# EAGLE design controller_board (EAGLE 9.6.2)
Drink Mixing Machine -- Controller Board v3.1
REVISION: v3.1
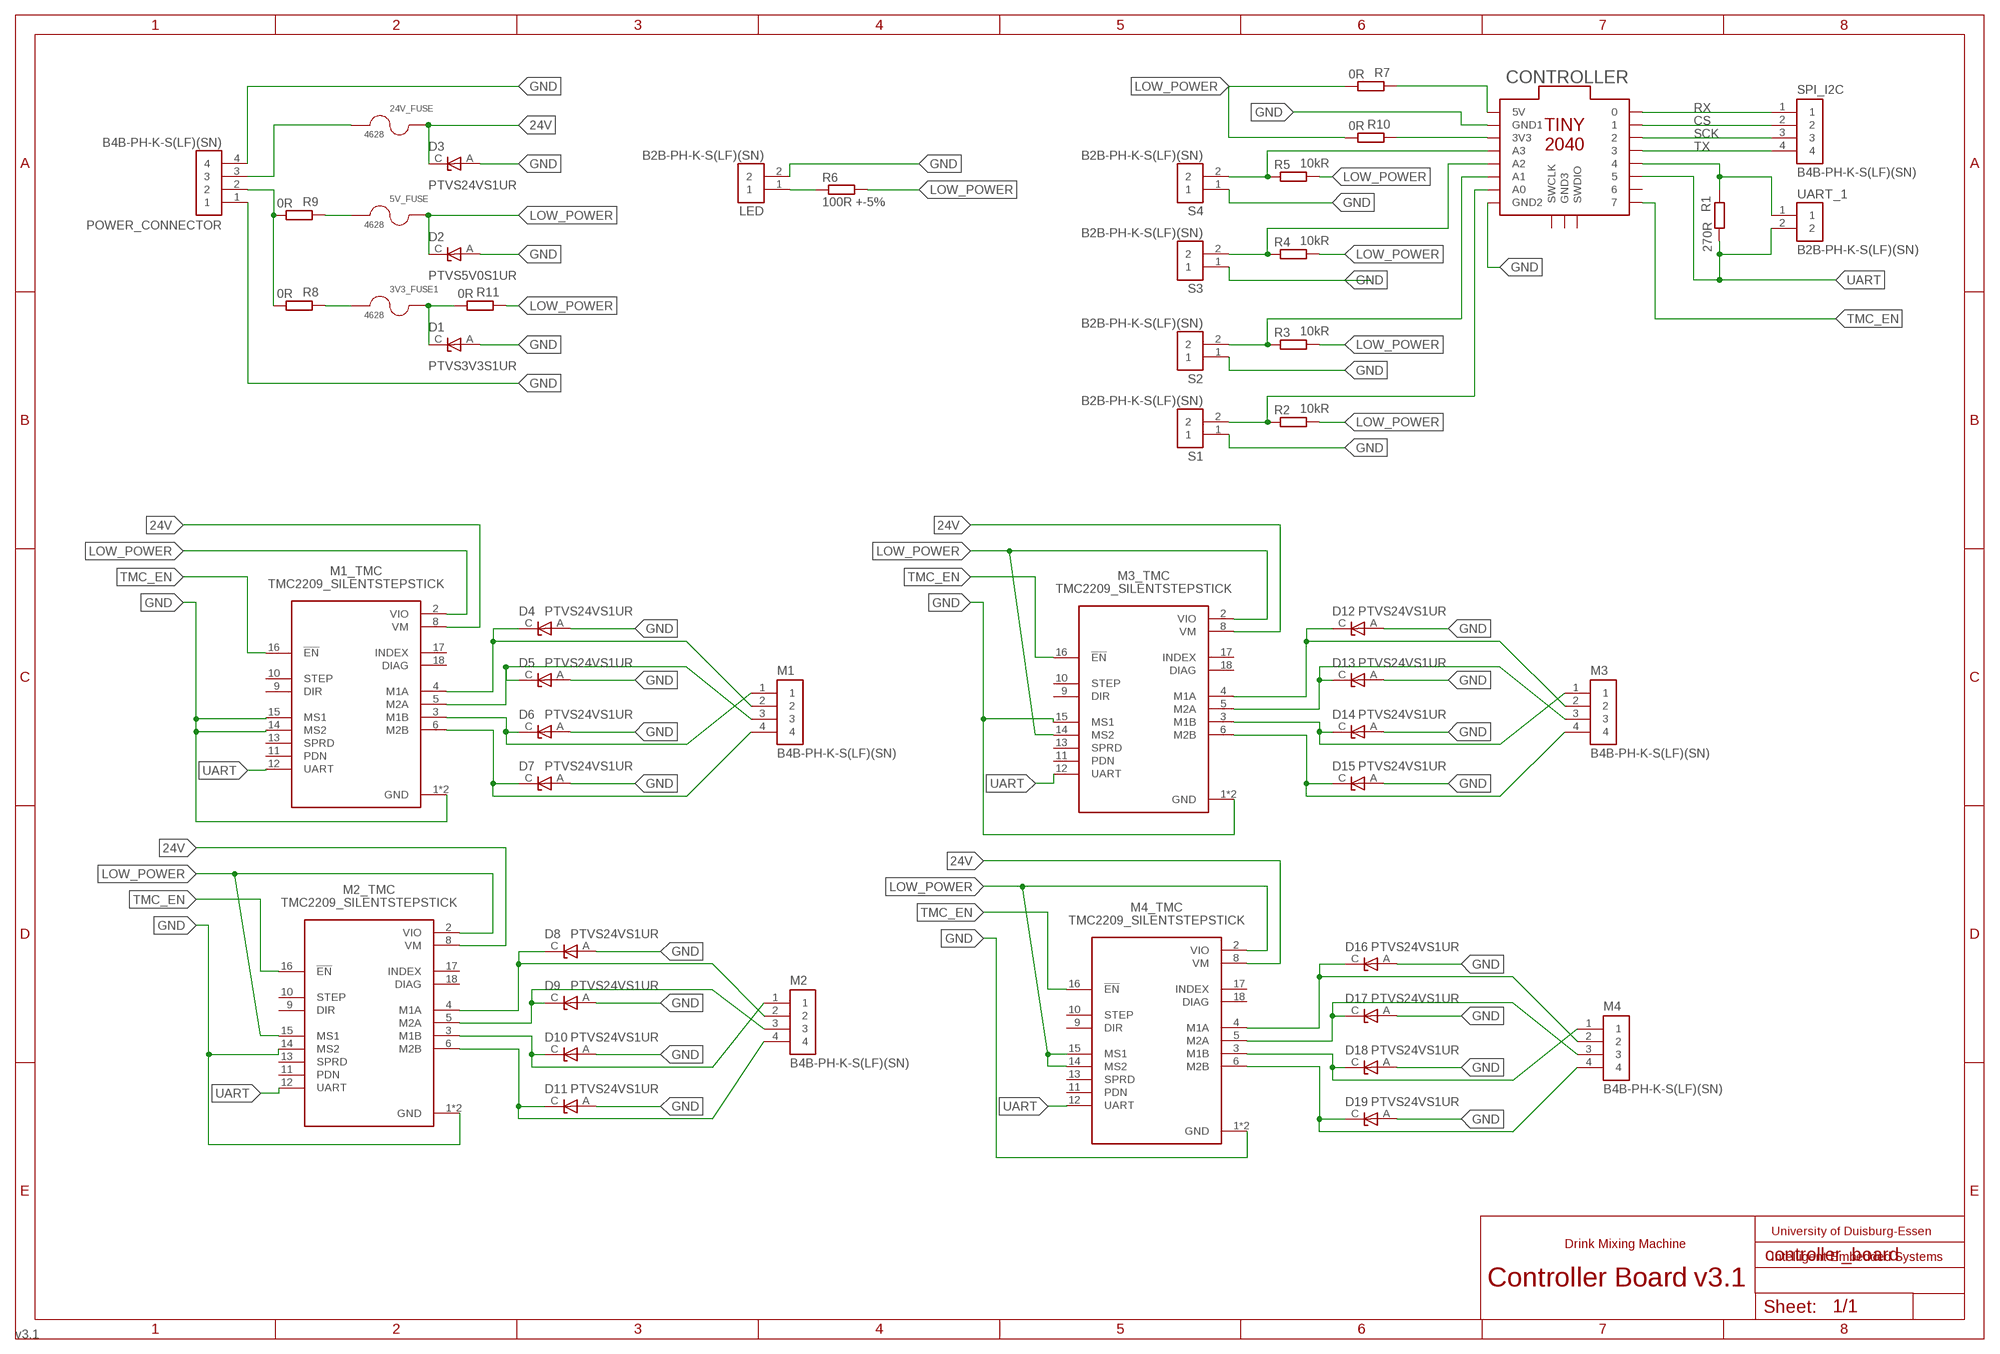
[diagram p0: schematic, sheet 1]
FRAME1 (A3L-LOC): VERSION: v3.1

## Parts
3V3_FUSE1  4628  [FUSE_4628]
5V_FUSE  4628  [FUSE_4628]
24V_FUSE  4628  [FUSE_4628]
CONTROLLER  TINY2040_HEADER  [TINY2040_HEADER]
D1  PTVS3V3S1UR  [TVS_PTVS3V3S1UR]
D2  PTVS5V0S1UR  [TVS_PTVS5V0S1UR]
D3  PTVS24VS1UR  [TVS_PTVS24VS1UR]
D4  PTVS24VS1UR  [TVS_PTVS24VS1UR]
D5  PTVS24VS1UR  [TVS_PTVS24VS1UR]
D6  PTVS24VS1UR  [TVS_PTVS24VS1UR]
D7  PTVS24VS1UR  [TVS_PTVS24VS1UR]
D8  PTVS24VS1UR  [TVS_PTVS24VS1UR]
D9  PTVS24VS1UR  [TVS_PTVS24VS1UR]
D10  PTVS24VS1UR  [TVS_PTVS24VS1UR]
D11  PTVS24VS1UR  [TVS_PTVS24VS1UR]
D12  PTVS24VS1UR  [TVS_PTVS24VS1UR]
D13  PTVS24VS1UR  [TVS_PTVS24VS1UR]
D14  PTVS24VS1UR  [TVS_PTVS24VS1UR]
D15  PTVS24VS1UR  [TVS_PTVS24VS1UR]
D16  PTVS24VS1UR  [TVS_PTVS24VS1UR]
D17  PTVS24VS1UR  [TVS_PTVS24VS1UR]
D18  PTVS24VS1UR  [TVS_PTVS24VS1UR]
D19  PTVS24VS1UR  [TVS_PTVS24VS1UR]
LED  B2B-PH-K-S(LF)(SN)  [JST_B2B-PH-K-S(LF)(SN)]
M1  B4B-PH-K-S(LF)(SN)  [JST_B4B-PH-K-S(LF)(SN)]
M1_TMC  TMC2209_SILENTSTEPSTICK  [MODULE_TMC2209_SILENTSTEPSTICK]
M2  B4B-PH-K-S(LF)(SN)  [JST_B4B-PH-K-S(LF)(SN)]
M2_TMC  TMC2209_SILENTSTEPSTICK  [MODULE_TMC2209_SILENTSTEPSTICK]
M3  B4B-PH-K-S(LF)(SN)  [JST_B4B-PH-K-S(LF)(SN)]
M3_TMC  TMC2209_SILENTSTEPSTICK  [MODULE_TMC2209_SILENTSTEPSTICK]
M4  B4B-PH-K-S(LF)(SN)  [JST_B4B-PH-K-S(LF)(SN)]
M4_TMC  TMC2209_SILENTSTEPSTICK  [MODULE_TMC2209_SILENTSTEPSTICK]
POWER_CONNECTOR  B4B-PH-K-S(LF)(SN)  [JST_B4B-PH-K-S(LF)(SN)]
R1  270R  R-EU_R0805  [R0805]
R2  10kR  R-EU_R0805  [R0805]
R3  10kR  R-EU_R0805  [R0805]
R4  10kR  R-EU_R0805  [R0805]
R5  10kR  R-EU_R0805  [R0805]
R6  100R +-5%  R-EU_R0805  [R0805]
R7  0R  R-EU_R0805  [R0805]
R8  0R  R-EU_R0805  [R0805]
R9  0R  R-EU_R0805  [R0805]
R10  0R  R-EU_R0805  [R0805]
R11  0R  R-EU_R0805  [R0805]
S1  B2B-PH-K-S(LF)(SN)  [JST_B2B-PH-K-S(LF)(SN)]
S2  B2B-PH-K-S(LF)(SN)  [JST_B2B-PH-K-S(LF)(SN)]
S3  B2B-PH-K-S(LF)(SN)  [JST_B2B-PH-K-S(LF)(SN)]
S4  B2B-PH-K-S(LF)(SN)  [JST_B2B-PH-K-S(LF)(SN)]
SPI_I2C  B4B-PH-K-S(LF)(SN)  [JST_B4B-PH-K-S(LF)(SN)]
UART_1  B2B-PH-K-S(LF)(SN)  [JST_B2B-PH-K-S(LF)(SN)]

## Nets
3V3: 3V3_FUSE1.2 D1.C R11.2
24V: 24V_FUSE.2 D3.C M1_TMC.8(VM) M2_TMC.8(VM) M3_TMC.8(VM) M4_TMC.8(VM)
A0: CONTROLLER.A0 R2.1 S1.2
A1: CONTROLLER.A1 R3.1 S2.2
A2: CONTROLLER.A2 R4.1 S3.2
CS: CONTROLLER.1 SPI_I2C.2
GND: CONTROLLER.GND1 CONTROLLER.GND2 D1.A D2.A D3.A D4.A D5.A D6.A D7.A D8.A D9.A D10.A D11.A D12.A D13.A D14.A D15.A D16.A D17.A D18.A D19.A LED.2 M1_TMC.1(GND) M1_TMC.7(GND) M1_TMC.14(MS2) M1_TMC.15(MS1) M2_TMC.1(GND) M2_TMC.7(GND) M2_TMC.14(MS2) M3_TMC.1(GND) M3_TMC.7(GND) M3_TMC.15(MS1) M4_TMC.1(GND) M4_TMC.7(GND) POWER_CONNECTOR.1 POWER_CONNECTOR.4 S1.1 S2.1 S3.1 S4.1
LOW_POWER: 5V_FUSE.2 D2.C M1_TMC.2(VIO) M2_TMC.2(VIO) M2_TMC.15(MS1) M3_TMC.2(VIO) M3_TMC.14(MS2) M4_TMC.2(VIO) M4_TMC.14(MS2) M4_TMC.15(MS1) R2.2 R3.2 R4.2 R5.2 R6.2 R7.2 R10.2 R11.1
N$1: POWER_CONNECTOR.2 R8.2 R9.2
N$2: D4.C M1.2 M1_TMC.4(M1A)
N$3: 5V_FUSE.1 R9.1
N$4: D6.C M1.1 M1_TMC.3(M1B)
N$5: D8.C M2.2 M2_TMC.4(M1A)
N$6: D11.C M2.4 M2_TMC.6(M2B)
N$7: D9.C M2.3 M2_TMC.5(M2A)
N$8: D10.C M2.1 M2_TMC.3(M1B)
N$9: D12.C M3.2 M3_TMC.4(M1A)
N$10: D15.C M3.4 M3_TMC.6(M2B)
N$11: D13.C M3.3 M3_TMC.5(M2A)
N$12: D14.C M3.1 M3_TMC.3(M1B)
N$13: D16.C M4.2 M4_TMC.4(M1A)
N$14: D19.C M4.4 M4_TMC.6(M2B)
N$15: D17.C M4.3 M4_TMC.5(M2A)
N$16: D18.C M4.1 M4_TMC.3(M1B)
N$17: LED.1 R6.1
N$18: CONTROLLER.5V R7.1
N$19: D7.C M1.4 M1_TMC.6(M2B)
N$20: CONTROLLER.4 R1.1 UART_1.1
N$21: 3V3_FUSE1.1 R8.1
N$22: 24V_FUSE.1 POWER_CONNECTOR.3
N$23: CONTROLLER.3V3 R10.1
N$24: CONTROLLER.A3 R5.1 S4.2
N$26: D5.C M1.3 M1_TMC.5(M2A)
RX: CONTROLLER.0 SPI_I2C.1
SCK: CONTROLLER.2 SPI_I2C.3
TMC_EN: CONTROLLER.7 M1_TMC.16(!EN) M2_TMC.16(!EN) M3_TMC.16(!EN) M4_TMC.16(!EN)
TX: CONTROLLER.3 SPI_I2C.4
UART: CONTROLLER.5 M1_TMC.12(UART) M2_TMC.12(UART) M3_TMC.12(UART) M4_TMC.12(UART) R1.2 UART_1.2
Unconnected: CONTROLLER.6 CONTROLLER.GND3 CONTROLLER.SWCLK CONTROLLER.SWDIO M1_TMC.9(DIR) M1_TMC.10(STEP) M1_TMC.11(PDN) M1_TMC.13(SPRD) M1_TMC.17(INDEX) M1_TMC.18(DIAG) M2_TMC.9(DIR) M2_TMC.10(STEP) M2_TMC.11(PDN) M2_TMC.13(SPRD) M2_TMC.17(INDEX) M2_TMC.18(DIAG) M3_TMC.9(DIR) M3_TMC.10(STEP) M3_TMC.11(PDN) M3_TMC.13(SPRD) M3_TMC.17(INDEX) M3_TMC.18(DIAG) M4_TMC.9(DIR) M4_TMC.10(STEP) M4_TMC.11(PDN) M4_TMC.13(SPRD) M4_TMC.17(INDEX) M4_TMC.18(DIAG)

## Notes on the sheet
- University of Duisburg-Essen
- Drink Mixing Machine
- Intelligent Embedded Systems
- Controller Board

## Library data of the parts
3V3_FUSE1 5V_FUSE 24V_FUSE = 4628:4628: Check availability <https://pricing.snapeda.com/parts/4628/Keystone/view-part?ref=eda>; AVAILABILITY: In Stock; DESCRIPTION: 5mm Slim Line Fuse holder; MF: Keystone; MP: 4628; PACKAGE: None; PRICE: None; PURCHASE-URL: https://pricing.snapeda.com/search?q=4628&ref=eda
CONTROLLER = tiny2040_headerd:TINY2040_HEADER
D1 = PTVS3V3S1UR:PTVS3V3S1UR: Check availability <https://pricing.snapeda.com/parts/PTVS3V3S1UR/Nexperia/view-part?ref=eda>; AVAILABILITY: In Stock; CHECK_PRICES: https://www.snapeda.com/parts/PTVS3V3S1UR/Nexperia/view-part/?ref=eda; DESCRIPTION: Diode TVS Single Uni-Dir 3.3V 400W Automotive 2-Pin SOD-123W T/R; MF: Nexperia; MP: PTVS3V3S1UR; PACKAGE: None; PRICE: None; SNAPEDA_LINK: https://www.snapeda.com/parts/PTVS3V3S1UR/Nexperia/view-part/?ref=snap
D2 = PTVS5V0S1UR:PTVS5V0S1UR: Check availability <https://pricing.snapeda.com/parts/PTVS5V0S1UR/Nexperia%20USA/view-part?ref=eda>; AVAILABILITY: In Stock; CHECK_PRICES: https://www.snapeda.com/parts/PTVS5V0S1UR/Nexperia/view-part/?ref=eda; DESCRIPTION: 9.2V Clamp 43.5A Ipp Tvs Diode Surface Mount SOD-123W; MF: Nexperia USA; MP: PTVS5V0S1UR; PACKAGE: SOD-123 Nexperia USA; PRICE: None; PURCHASE-URL: https://www.snapeda.com/api/url_track_click_mouser/?unipart_id=2712262&manufacturer=Nexperia USA&part_name=PTVS5V0S1UR&search_term=ptvs5v0s1ur; SNAPEDA_LINK: https://www.snapeda.com/parts/PTVS5V0S1UR/Nexperia/view-part/?ref=snap
D3-D19 = PTVS24VS1UR:PTVS24VS1UR: Check availability <https://pricing.snapeda.com/parts/PTVS24VS1UR/Nexperia/view-part?ref=eda>; AVAILABILITY: In Stock; CHECK_PRICES: https://www.snapeda.com/parts/PTVS24VS1UR/Nexperia/view-part/?ref=eda; DESCRIPTION: TVS Diode Single Uni-Dir 24V 400W Automotive 2-Pin SOD-123W T/R; MF: Nexperia; MP: PTVS24VS1UR; PACKAGE: None; PRICE: None; SNAPEDA_LINK: https://www.snapeda.com/parts/PTVS24VS1UR/Nexperia/view-part/?ref=snap
LED S1-S4 UART_1 = B2B-PH-K-S_LF__SN_:B2B-PH-K-S(LF)(SN): PH Series 2 Position 2 mm Pitch Through Hole Top Entry Shrouded Header Check availability <https://pricing.snapeda.com/parts/B2B-PH-K-S%20%28LF%29%28SN%29/JST/view-part?ref=eda>; AVAILABILITY: In Stock; DESCRIPTION: Connector Header Through Hole 2 position 0.079 (2.00mm); MF: JST; MP: B2B-PH-K-S (LF)(SN); PACKAGE: None; PRICE: None
M1-M4 POWER_CONNECTOR SPI_I2C = B4B-PH-K-S_LF__SN_:B4B-PH-K-S(LF)(SN): PH Series 4 Position 2 mm Pitch Through Hole Crimp Top Entry Shrouded Header Check availability <https://pricing.snapeda.com/parts/B4B-PH-K-S%28LF%29%28SN%29/JST%20Sales/view-part?ref=eda>; AVAILABILITY: In Stock; DESCRIPTION: Connector Header Through Hole 4 position 0.079 (2.00mm); MF: JST Sales; MP: B4B-PH-K-S(LF)(SN); PACKAGE: None; PRICE: None
M1_TMC M2_TMC M3_TMC M4_TMC = TMC2209_SILENTSTEPSTICK:TMC2209_SILENTSTEPSTICK: Check availability <https://pricing.snapeda.com/parts/TMC2209%20SILENTSTEPSTICK/Trinamic%20Motion%20Control%20GmbH/view-part?ref=eda>; AVAILABILITY: In Stock; DESCRIPTION: TMC2209 Motor Controller/Driver Power Management Evaluation Board; MF: Trinamic Motion Control GmbH; MP: TMC2209 SILENTSTEPSTICK; PACKAGE: None; PRICE: None; PURCHASE-URL: https://pricing.snapeda.com/search?q=TMC2209 SILENTSTEPSTICK&ref=eda
R1-R11 = rcl:R-EU_: RESISTOR, European symbol; SPICEPREFIX: R

## Board
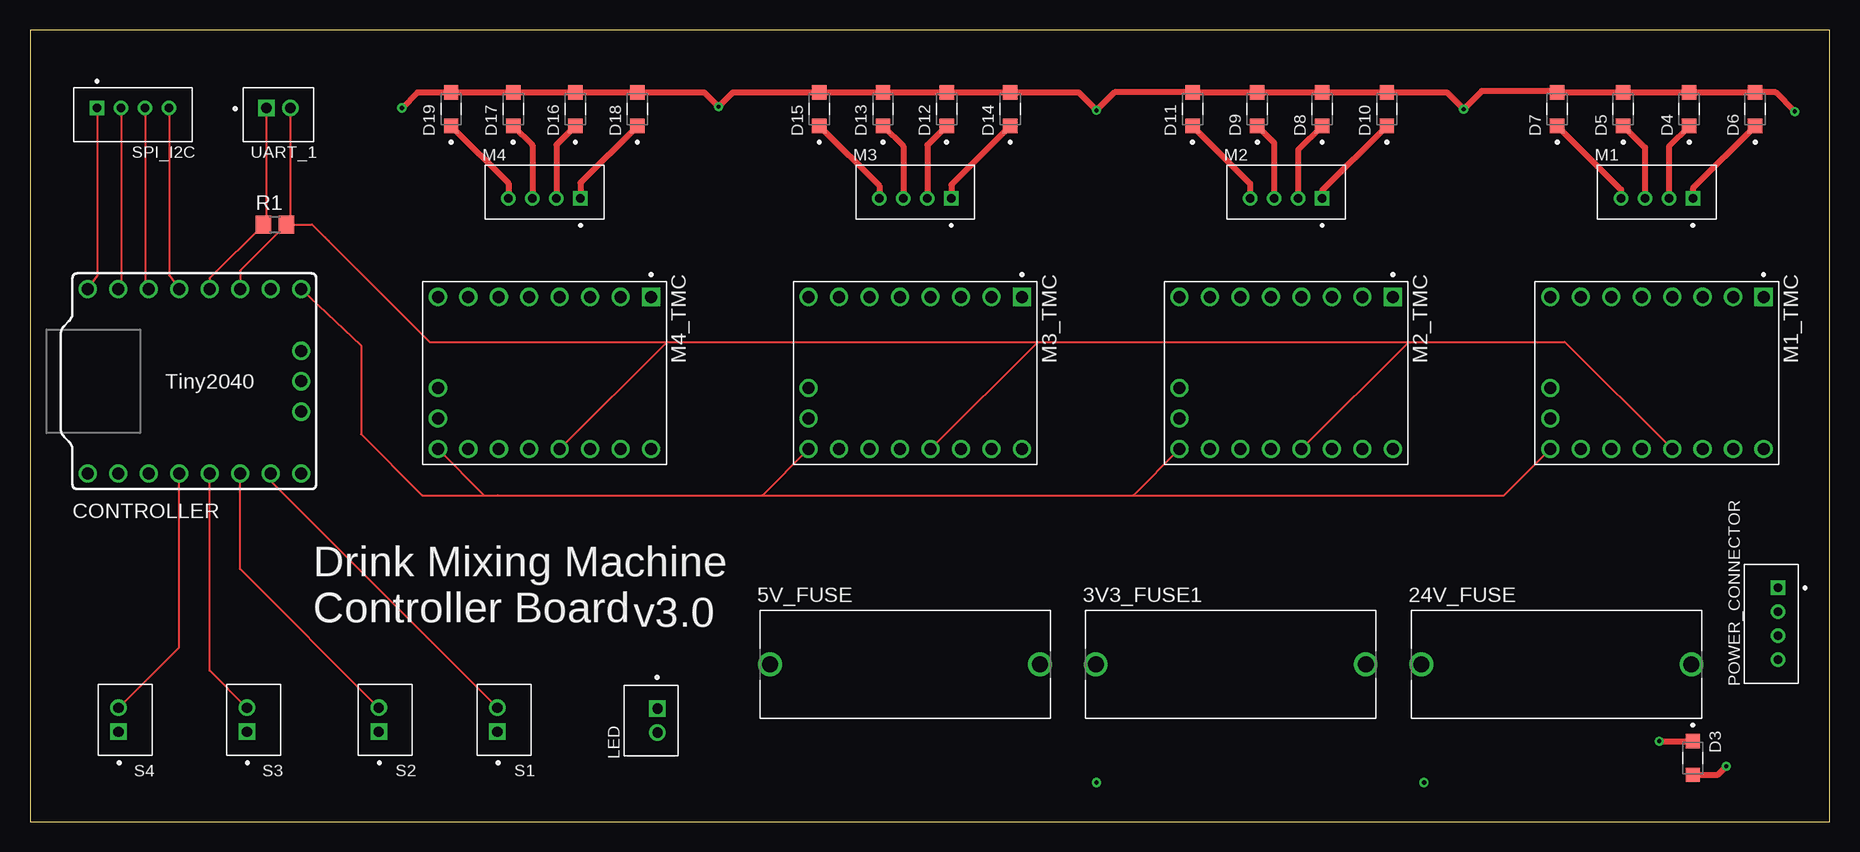
[diagram p1: board, top side]
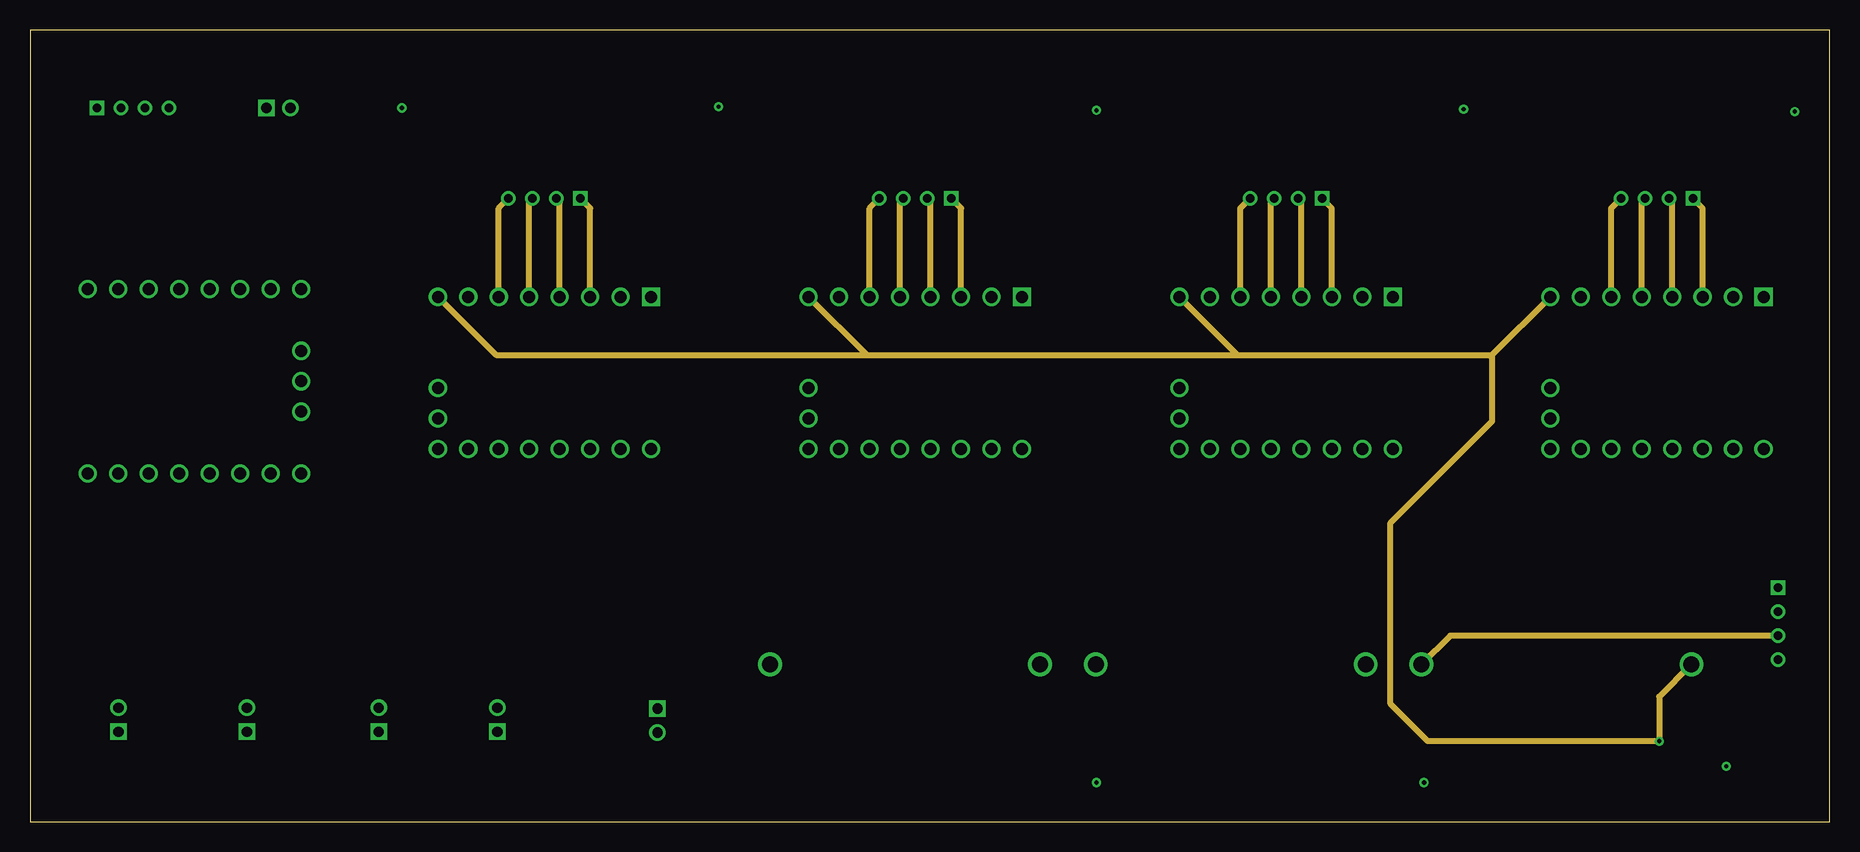
[diagram p2: board, inner layer Route2]
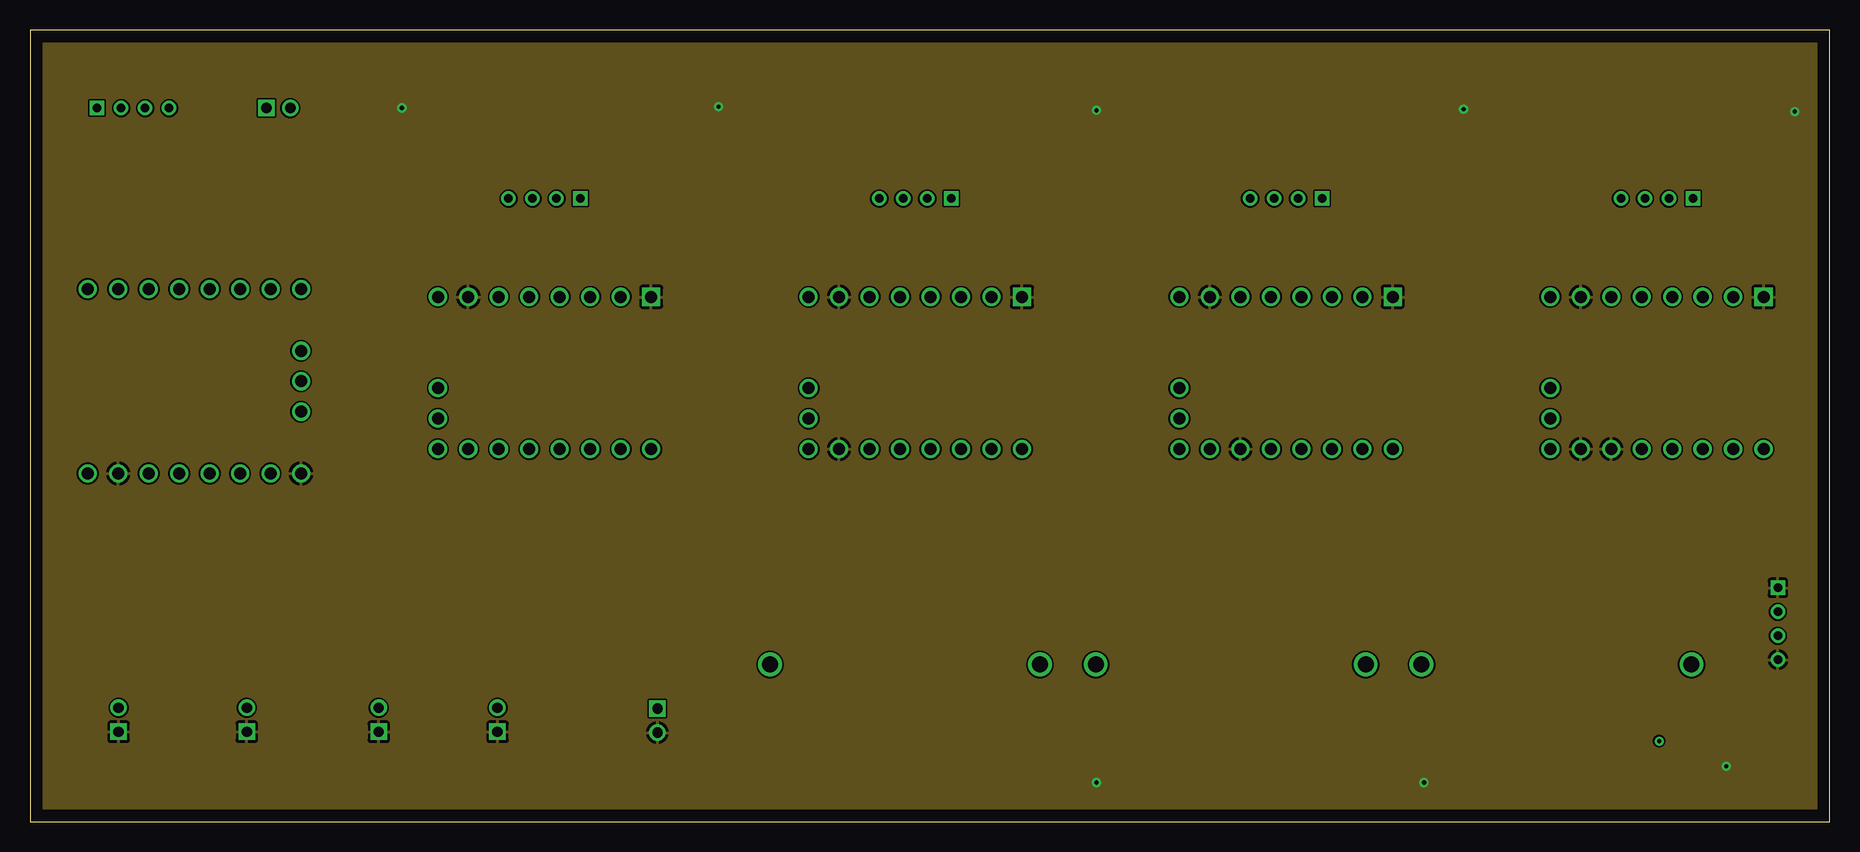
[diagram p3: board, inner layer Route15]
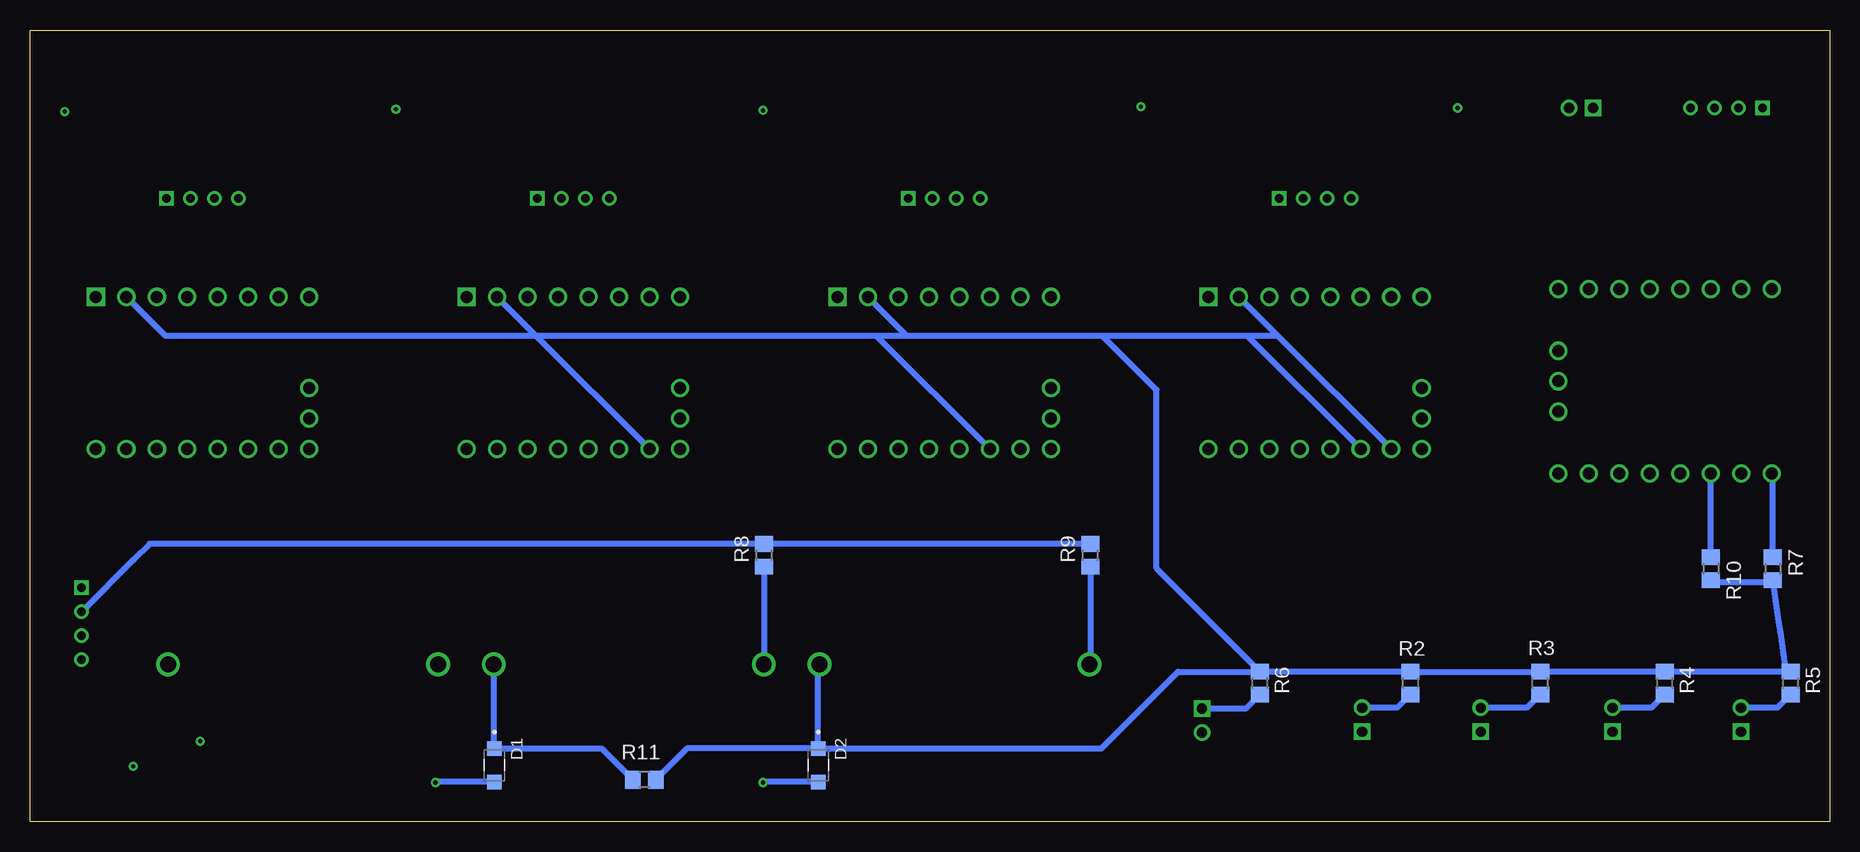
[diagram p4: board, bottom side, seen from below]

Size 150 x 66 mm. Coordinates in mm from the lower left corner, seen from the top.
Outline: 0,0 150,0 150,66 0,66 0,0
Copper layers (1+2*15+16): Top 0.035mm / dielectric 1.5mm / Route2 0.035mm / dielectric 0.15mm / Route15 0.035mm / dielectric 0.2mm / Bottom 0.035mm
Design rules "default *": minimum track width 6mil, minimum drill 0.35mm, track to track 6mil, track to pad 6mil, pad to pad 6mil, via to via 6mil, smd to smd 6mil, copper to edge 40mil, drill to drill 6mil, minimum pad ring 10mil, minimum via ring 8mil, stop-mask expansion 4mil, vias tented up to drill 0mil, thermal gap 10mil

### Footprints (pad centres in the part's own frame; a part is rotated, then mirrored left to right if it is on the bottom)
FUSE_4628 = drill 1.32: 1 -11.25,0; 2 11.25,0
TINY2040_HEADER = drill 1 pad 1.27: 0 1.27,7.68; 1 3.81,7.68; 2 6.35,7.68; 3 8.89,7.68; 3V3 6.35,-7.68; 4 11.43,7.68; 5 13.97,7.68; 5V 1.27,-7.68; 6 16.51,7.68; 7 19.05,7.68; A0 16.51,-7.68; A1 13.97,-7.68; A2 11.43,-7.68; A3 8.89,-7.68; GND1 3.81,-7.68; GND2 19.05,-7.68; GND3 19.05,0; SWCLK 19.05,-2.54; SWDIO 19.05,2.54
TVS_PTVS3V3S1UR = smd 1.2 x 1.2: A 1.4,0; C -1.4,0
TVS_PTVS5V0S1UR = smd 1.2 x 1.2: A 1.4,0; C -1.4,0
TVS_PTVS24VS1UR = smd 1.2 x 1.2: A 1.4,0; C -1.4,0
JST_B2B-PH-K-S(LF)(SN) = drill 0.86 square: 1 1,-0.55 | drill 0.86: 2 -1,-0.55
JST_B4B-PH-K-S(LF)(SN) = drill 0.7 square: 1 3,-0.55 | drill 0.7: 2 1,-0.55; 3 -1,-0.55; 4 -3,-0.55
MODULE_TMC2209_SILENTSTEPSTICK = drill 1 square: 1 -6.35,8.89 | drill 1: 2 -6.35,6.35; 3 -6.35,3.81; 4 -6.35,1.27; 5 -6.35,-1.27; 6 -6.35,-3.81; 7 -6.35,-6.35; 8 -6.35,-8.89; 9 6.35,8.89; 10 6.35,6.35; 11 6.35,3.81; 12 6.35,1.27; 13 6.35,-1.27; 14 6.35,-3.81; 15 6.35,-6.35; 16 6.35,-8.89; 17 1.27,-8.89; 18 3.81,-8.89
R0805 = smd 1.3 x 1.5: 1 -0.95,0; 2 0.95,0

### Placement (x,y rotation side)
3V3_FUSE1  100.09,13.1 0 top
5V_FUSE  72.94,13.1 0 top
24V_FUSE  127.24,13.1 0 top
CONTROLLER  3.54,36.71 0 top
D1  111.3,4.7 270 bottom
D2  84.3,4.7 270 bottom
D3  138.6,5.3 270 top
D4  138.3,59.4 90 top
D5  132.8,59.4 90 top
D6  143.8,59.4 90 top
D7  127.3,59.4 90 top
D8  107.7,59.4 90 top
D9  102.3,59.4 90 top
D10  113.1,59.4 90 top
D11  96.9,59.4 90 top
D12  76.4,59.4 90 top
D13  71.1,59.4 90 top
D14  81.7,59.4 90 top
D15  65.8,59.4 90 top
D16  45.46,59.4 90 top
D17  40.28,59.4 90 top
D18  50.63,59.4 90 top
D19  35.1,59.4 90 top
LED  51.76,8.41 90 top
M1  135.61,52.5 0 top
M1_TMC  135.61,37.4 270 top
M2  104.7,52.5 0 top
M2_TMC  104.7,37.4 270 top
M3  73.8,52.5 0 top
M3_TMC  73.8,37.4 270 top
M4  42.89,52.5 0 top
M4_TMC  42.89,37.4 270 top
POWER_CONNECTOR  145.15,16.49 90 top
R1  20.41,49.79 0 top
R2  34.92,11.55 90 bottom
R3  24.12,11.55 90 bottom
R4  13.72,11.55 90 bottom
R5  3.22,11.55 90 bottom
R6  47.48,11.55 90 bottom
R7  4.74,21.09 270 bottom
R8  88.8,22.2 90 bottom
R9  61.6,22.2 90 bottom
R10  9.9,21.09 270 bottom
R11  98.8,3.5 180 bottom
S1  39.52,8.48 270 top
S2  29.62,8.48 270 top
S3  18.63,8.48 270 top
S4  7.93,8.48 270 top
SPI_I2C  8.59,58.94 180 top
UART_1  20.7,58.94 180 top

### Tracks (layer width: path | path; a pad name or v marks a point on that pad's centre or on a via)
3V3
  Bottom 0.508: 3V3_FUSE1.2 111.3,13.06 D1.C 102.35,6.1 R11.2
24V  (via drill 0.35)
  Top 0.508: v135.8,6.7 D3.C
  Route2 0.508: 24V_FUSE.2 135.8,10.41 v135.8,6.7 116.5,6.7 113.4,9.8 113.4,24.9 121.85,33.35 121.87,33.37 121.87,38.9 | M4_TMC.8 38.85,38.9 69.76,38.9 | 69.76,38.9 100.66,38.9 | 100.66,38.9 121.87,38.9 | M3_TMC.8 69.76,38.9 | M2_TMC.8 100.66,38.9 | M1_TMC.8 121.87,38.9 | 121.77,38.8 121.87,38.9
A0
  Top 0.152: S1.2 20.05,28.4 CONTROLLER.A0
  Bottom 0.508: R2.1 36.03,9.48 S1.2
A1
  Top 0.152: S2.2 17.51,21.04 CONTROLLER.A1
  Bottom 0.508: R3.1 25.23,9.48 S2.2
A2
  Top 0.152: S3.2 14.97,12.59 CONTROLLER.A2
  Bottom 0.508: R4.1 14.83,9.48 S3.2
CS
  Top 0.152: SPI_I2C.2 7.59,44.95 CONTROLLER.1
GND  (via drill 0.35)
  Top 0.508: v141.4,4.6 140.7,3.9 D3.A | v31,59.5 32.3,60.8 D19.A D17.A D16.A D18.A 56.2,60.8 v57.4,59.6 58.6,60.8 D15.A D13.A D12.A D14.A 87.4,60.8 v88.9,59.3 90.4,60.8 D11.A D9.A D8.A D10.A 118.1,60.8 v119.5,59.4 121,60.9 127.2,60.9 D7.A D5.A D4.A D6.A 145.5,60.8 v147.1,59.2
  Bottom 0.508: D2.A 88.85,3.3 v88.9,3.25 | D1.A 116.15,3.3 v116.2,3.25
  pour Route15: 151.2,-1.2 151.2,67.8 -1.3,67.8 -1.3,-1.2
LOW_POWER
  Bottom 0.508: R7.2 4.72,20 | 4.72,20 4.25,16.69 4.12,15.78 3.73,13.01 R5.2 R4.2 R3.2 R2.2 R6.2 | M4_TMC.15 45.99,40.5 | 45.99,40.5 48.53,40.5 | 48.53,40.5 60.6,40.5 | 60.6,40.5 76.9,40.5 | 76.9,40.5 79.44,40.5 | 79.44,40.5 107.8,40.5 | 107.8,40.5 138.7,40.5 M1_TMC.2 | M2_TMC.2 107.8,40.5 | M3_TMC.2 76.9,40.5 | M4_TMC.2 45.99,40.5 | M4_TMC.14 48.53,40.5 | M3_TMC.14 79.44,40.5 | M2_TMC.15 107.8,40.5 | R6.2 54.3,12.5 60.7,6.1 D2.C | R6.2 56.1,21.12 56.1,36 60.6,40.5 | R10.2 9.76,20 4.72,20 | D2.C 84.3,12.99 5V_FUSE.2 | D2.C 95.25,6.1 R11.1
N$1
  Bottom 0.508: POWER_CONNECTOR.2 141.34,21.84 140.04,23.15 R8.2 R9.2
N$2
  Top 0.508: D4.C 136.61,56.31 M1.2
  Route2 0.508: M1_TMC.4 136.88,51.68 M1.2
N$3
  Bottom 0.508: R9.1 61.6,13.19 5V_FUSE.1
N$4
  Top 0.508: D6.C 138.61,52.81 M1.1
  Route2 0.508: M1_TMC.3 139.42,51.14 M1.1
N$5
  Top 0.508: D8.C 105.7,56 M2.2
  Route2 0.508: M2_TMC.4 105.97,51.68 M2.2
N$6
  Top 0.508: D11.C 101.7,53.2 M2.4
  Route2 0.508: M2_TMC.6 100.89,51.14 M2.4
N$7
  Top 0.508: D9.C 103.7,56.6 M2.3
  Route2 0.508: M2_TMC.5 103.43,51.68 M2.3
N$8
  Top 0.508: D10.C 107.7,52.6 M2.1
  Route2 0.508: M2_TMC.3 108.51,51.14 M2.1
N$9
  Top 0.508: D12.C 74.8,56.4 M3.2
  Route2 0.508: M3_TMC.4 75.07,51.68 M3.2
N$10
  Top 0.508: D15.C 70.8,53 M3.4
  Route2 0.508: M3_TMC.6 69.99,51.14 M3.4
N$11
  Top 0.508: D13.C 72.8,56.3 M3.3
  Route2 0.508: M3_TMC.5 72.53,51.68 M3.3
N$12
  Top 0.508: D14.C 76.8,53.1 M3.1
  Route2 0.508: M3_TMC.3 77.61,51.14 M3.1
N$13
  Top 0.508: D16.C 43.89,56.43 M4.2
  Route2 0.508: M4_TMC.4 44.16,51.68 M4.2
N$14
  Top 0.508: D19.C 39.89,53.21 M4.4
  Route2 0.508: M4_TMC.6 39.08,51.14 M4.4
N$15
  Top 0.508: D17.C 41.89,56.39 M4.3
  Route2 0.508: M4_TMC.5 41.62,51.68 M4.3
N$16
  Top 0.508: D18.C 45.89,53.26 M4.1
  Route2 0.508: M4_TMC.3 46.7,51.14 M4.1
N$17
  Bottom 0.508: R6.1 48.66,9.41 LED.1
N$18
  Bottom 0.508: R7.1 4.74,28.64 CONTROLLER.5V
N$19
  Top 0.508: D7.C 132.61,52.69 M1.4
  Route2 0.508: M1_TMC.6 131.8,51.14 M1.4
N$20
  Top 0.152: CONTROLLER.4 14.97,45.3 R1.1 19.7,50.03 UART_1.1
N$21
  Bottom 0.508: R8.1 88.8,13.14 3V3_FUSE1.1
N$22
  Route2 0.508: POWER_CONNECTOR.3 118.38,15.49 24V_FUSE.1
N$23
  Bottom 0.508: R10.1 9.9,28.7 CONTROLLER.3V3
N$24
  Top 0.152: S4.2 12.43,14.53 CONTROLLER.A3
  Bottom 0.508: R5.1 4.33,9.48 S4.2
N$26
  Top 0.508: D5.C 134.61,56.19 M1.3
  Route2 0.508: M1_TMC.5 134.34,51.68 M1.3
RX
  Top 0.152: SPI_I2C.1 5.59,45.49 CONTROLLER.0
SCK
  Top 0.152: SPI_I2C.3 9.59,45.01 CONTROLLER.2
TMC_EN
  Top 0.152: CONTROLLER.7 27.6,39.7 27.6,32.3 32.7,27.2 37.85,27.2 | 61.06,27.2 39,27.2 37.85,27.2 | 61.06,27.2 91.96,27.2 | 91.96,27.2 122.87,27.2 M1_TMC.16 | M2_TMC.16 91.96,27.2 | M3_TMC.16 61.06,27.2 | M4_TMC.16 37.85,27.2
TX
  Top 0.152: SPI_I2C.4 11.59,45.55 CONTROLLER.3
UART
  Top 0.152: M1_TMC.12 127.93,40 114.92,40 | 53.11,40 84.02,40 | 84.02,40 114.92,40 | M2_TMC.12 114.92,40 | M3_TMC.12 84.02,40 | M4_TMC.12 53.11,40 | 53.11,40 33.3,40 24.9,48.4 24.61,48.69 23.51,49.79 R1.2 | R1.2 17.51,45.94 CONTROLLER.5 | UART_1.2 21.7,50.13 R1.2

### Text on the board
tNames: Drink Mixing Machine / Controller Board